# EAGLE design WizFiShield (EAGLE 6.1)
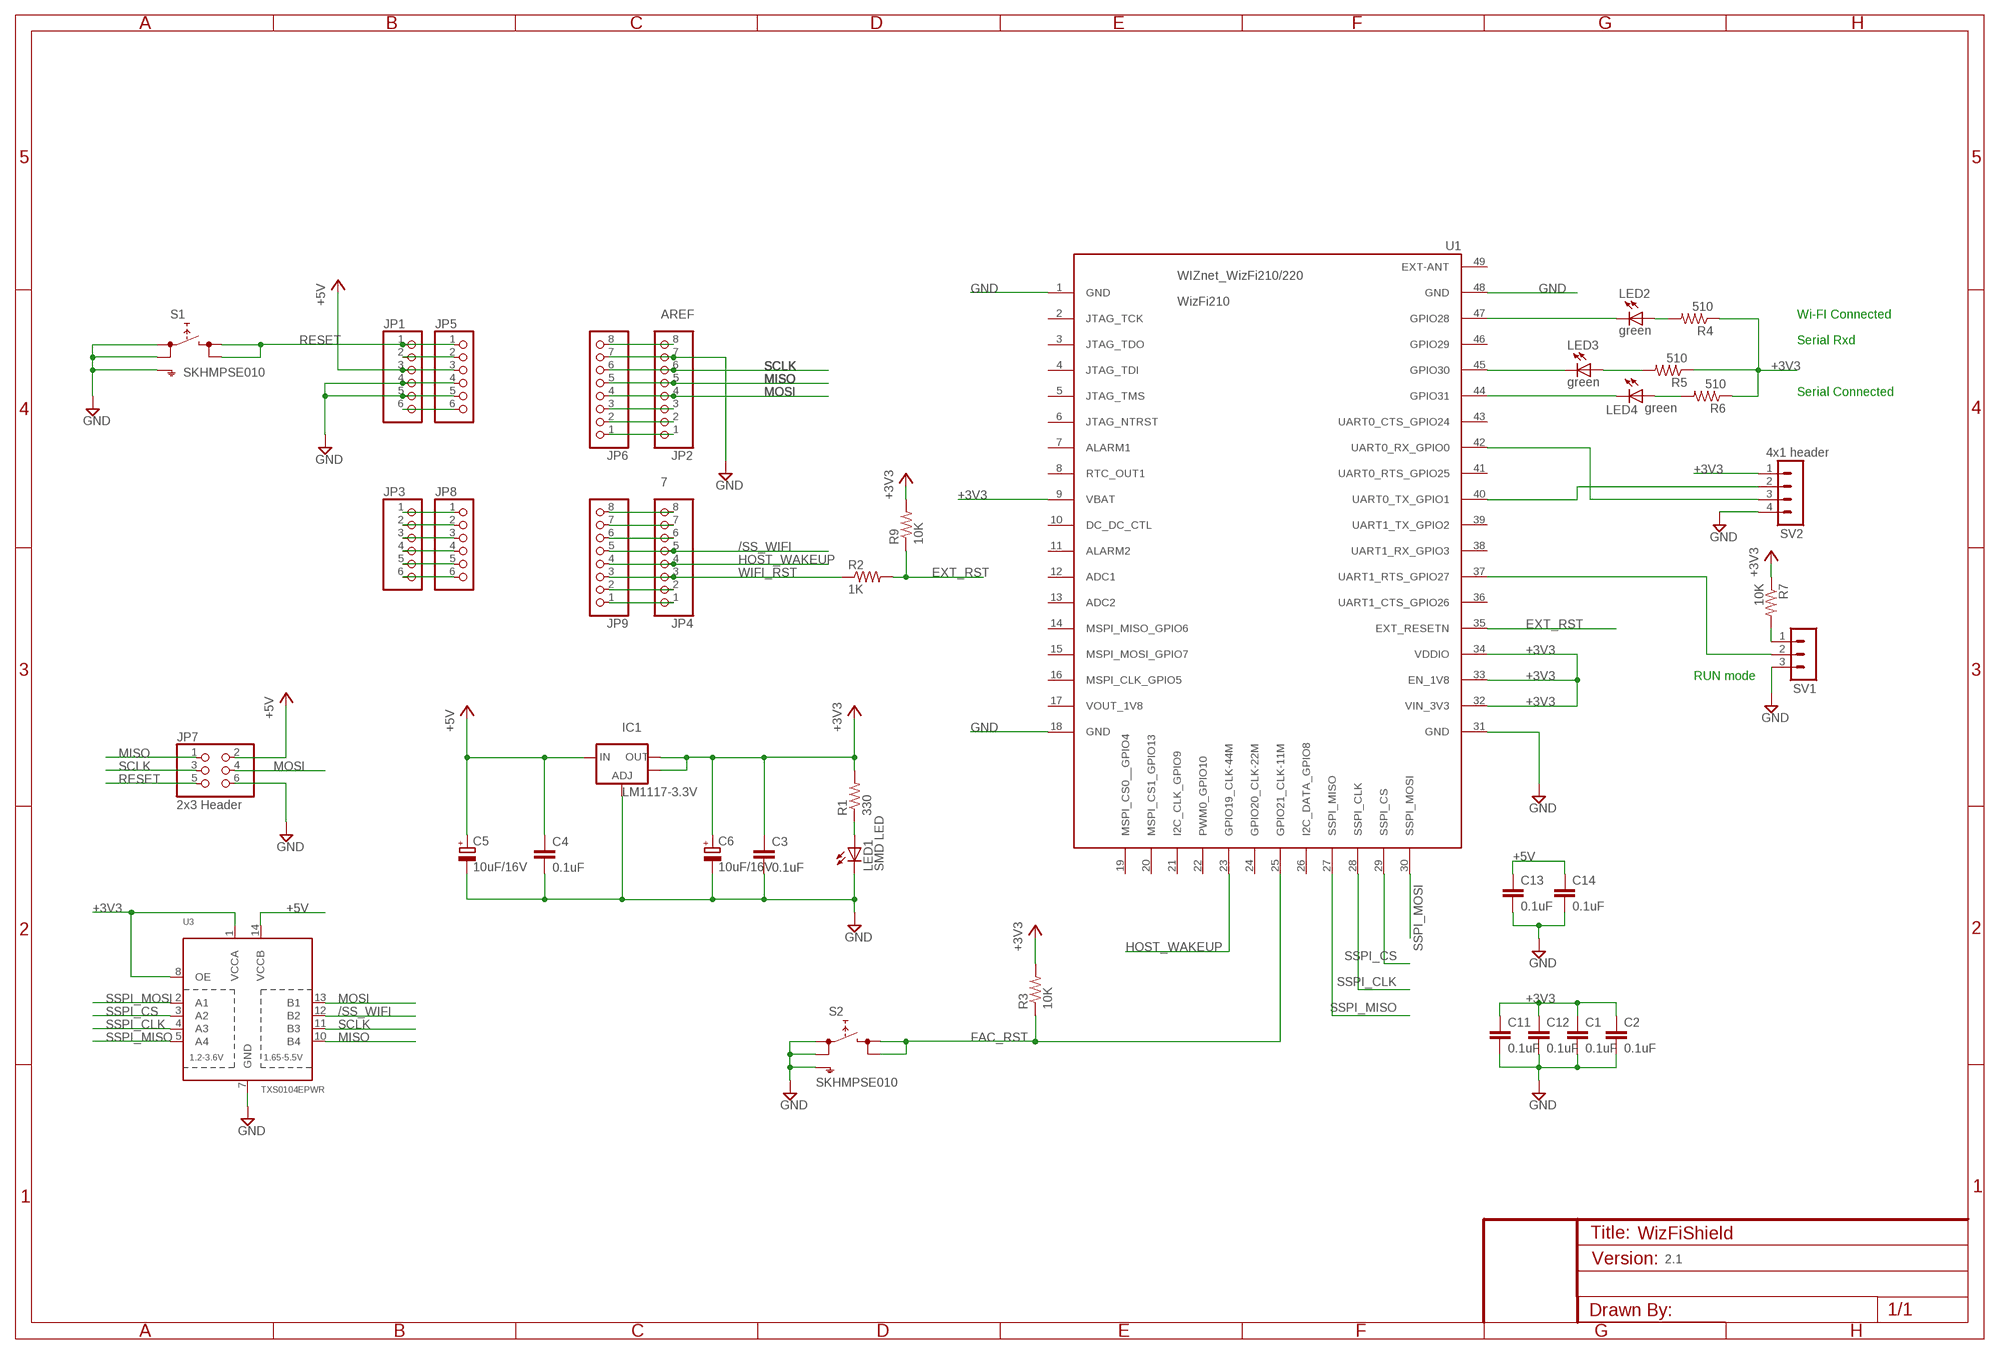
[diagram p0: schematic, sheet 1]

## Parts
C1  0.1uF  C-EUC0603  [C0603]
C2  0.1uF  C-EUC0603  [C0603]
C3  0.1uF  C-EUC0603  [C0603]
C4  0.1uF  C-EUC0603  [C0603]
C5  10uF/16V  CPOL-EUCT3216  [CT3216]
C6  10uF/16V  CPOL-EUCT3216  [CT3216]
C11  0.1uF  C-EUC0603  [C0603]
C12  0.1uF  C-EUC0603  [C0603]
C13  0.1uF  C-EUC0603  [C0603]
C14  0.1uF  C-EUC0603  [C0603]
IC1  LM1117-3.3V  V_REG_LM1117SOT223  [SOT223]
JP1  PINHD-1X6  [1X06]
JP2  PINHD-1X8  [1X08]
JP3  PINHD-1X6  [1X06]
JP4  PINHD-1X8  [1X08]
JP5  PINHD-1X6  [1X06]
JP6  PINHD-1X8  [1X08]
JP7  2x3 Header  PINHD-2X3  [2X03]
JP8  PINHD-1X6  [1X06]
JP9  PINHD-1X8  [1X08]
LED1  SMD LED  LEDCHIP-LED0805  [CHIP-LED0805]
LED2  green  LEDCHIP-LED0805  [CHIP-LED0805]
LED3  green  LEDCHIP-LED0805  [CHIP-LED0805]
LED4  green  LEDCHIP-LED0805  [CHIP-LED0805]
R1  330  R-US_R0805  [R0805]
R2  1K  RESISTOR0603-RES  [0603-RES]
R3  10K  RESISTOR0603-RES  [0603-RES]
R4  510  RESISTOR0603-RES  [0603-RES]
R5  510  RESISTOR0603-RES  [0603-RES]
R6  510  RESISTOR0603-RES  [0603-RES]
R7  10K  RESISTOR0603-RES  [0603-RES]
R9  10K  RESISTOR0603-RES  [0603-RES]
S1  SKHMPSE010  [SKHMPXE010]
S2  SKHMPSE010  [SKHMPXE010]
SV1  MA03-1  [MA03-1]
SV2  4x1 header  MA04-1  [MA04-1]
U1  WizFi210  WIZFI210/220  [WIZFI210/220]
U3  TXS0104EPWR  TXB0104PWR  [TSSOP14]

## Nets
+3V3: C1.1 C2.1 C3.1 C6.+ C11.1 C12.1 IC1.2(OUT) IC1.4(OUT) R1.2 R3.2 R4.1 R5.1 R6.1 R7.1 R9.2 SV2.1 U1.9(VBAT) U1.32(VIN_3V3) U1.33(EN_1V8) U1.34(VDDIO) U3.1(VCCA) U3.8(OE)
+5V: C4.1 C5.+ C13.1 C14.1 IC1.3(IN) JP1.3 JP5.3 JP7.2 U3.14(VCCB)
/INT_WIZ: JP2.1 JP6.1
/RESET_WIZ: JP4.6 JP9.6
/SD_DET: JP4.8 JP9.8
/SS_SD: JP2.2 JP6.2
/SS_WIFI: JP4.5 JP9.5 U3.12(B2)
/SS_WIZ: JP2.3 JP6.3
EXT_RST: R2.2 R9.1 U1.35(EXT_RESETN)
FAC_RST: R3.1 S2.3(2.1) S2.4(2.2) U1.25(GPIO21_CLK-11M)
GND: C1.2 C2.2 C3.2 C4.2 C5.- C6.- C11.2 C12.2 C13.2 C14.2 IC1.1(ADJ) JP1.4 JP1.5 JP2.7 JP5.4 JP5.5 JP6.7 JP7.6 LED1.C S1.1(1.1) S1.2(1.2) S1.5(SH) S2.1(1.1) S2.2(1.2) S2.5(SH) SV1.3 SV2.4 U1.1(GND) U1.18(GND) U1.31(GND) U1.48(GND) U3.7(GND)
GPIO28: LED2.C U1.47(GPIO28)
GPIO30: LED3.C U1.45(GPIO30)
GPIO31: LED4.C U1.44(GPIO31)
HOST_WAKEUP: JP4.4 JP9.4 U1.23(GPIO19_CLK-44M)
MISO: JP2.5 JP6.5 JP7.1 U3.10(B4)
MOSI: JP2.4 JP6.4 JP7.4 U3.13(B1)
N$1: R7.2 SV1.1
N$2: JP3.1 JP8.1
N$3: JP3.2 JP8.2
N$4: JP3.3 JP8.3
N$5: SV1.2 U1.37(UART1_RTS_GPIO27)
N$6: JP3.4 JP8.4
N$8: JP3.5 JP8.5
N$9: JP3.6 JP8.6
N$10: JP2.8 JP6.8
N$11: JP4.2 JP9.2
N$12: JP4.1 JP9.1
N$13: JP1.6 JP5.6
N$14: JP1.2 JP5.2
N$15: LED1.A R1.1
N$50: LED2.A R4.2
N$51: LED3.A R5.2
N$53: LED4.A R6.2
PWDN: JP4.7 JP9.7
RESET: JP1.1 JP5.1 JP7.5 S1.3(2.1) S1.4(2.2)
SCLK: JP2.6 JP6.6 JP7.3 U3.11(B3)
SSPI_CLK: U1.28(SSPI_CLK) U3.4(A3)
SSPI_CS: U1.29(SSPI_CS) U3.3(A2)
SSPI_MISO: U1.27(SSPI_MISO) U3.5(A4)
SSPI_MOSI: U1.30(SSPI_MOSI) U3.2(A1)
UART0_RX: SV2.3 U1.42(UART0_RX_GPIO0)
UART0_TX: SV2.2 U1.40(UART0_TX_GPIO1)
WIFI_RST: JP4.3 JP9.3 R2.1
Unconnected: U1.2(JTAG_TCK) U1.3(JTAG_TDO) U1.4(JTAG_TDI) U1.5(JTAG_TMS) U1.6(JTAG_NTRST) U1.7(ALARM1) U1.8(RTC_OUT1) U1.10(DC_DC_CTL) U1.11(ALARM2) U1.12(ADC1) U1.13(ADC2) U1.14(MSPI_MISO_GPIO6) U1.15(MSPI_MOSI_GPIO7) U1.16(MSPI_CLK_GPIO5) U1.17(VOUT_1V8) U1.19(MSPI_CS0__GPIO4) U1.20(MSPI_CS1_GPIO13) U1.21(I2C_CLK_GPIO9) U1.22(PWM0_GPIO10) U1.24(GPIO20_CLK-22M) U1.26(I2C_DATA_GPIO8) U1.36(UART1_CTS_GPIO26) U1.38(UART1_RX_GPIO3) U1.39(UART1_TX_GPIO2) U1.41(UART0_RTS_GPIO25) U1.43(UART0_CTS_GPIO24) U1.46(GPIO29) U1.49(EXT-ANT)

## Notes on the sheet
- AREF | Wi-FI Connected
- Serial Rxd
- SCLK
- MISO
- MOSI | Serial Connected
- 7
- RUN mode
- 2.1

## Library data of the parts
C1-C4 C11-C14 = resistor:C-EU: CAPACITOR, European symbol
C5 C6 = rcl:CPOL-EU: POLARIZED CAPACITOR, European symbol
IC1 = SparkFun:V_REG_LM1117: Voltage Regulator LM1117 Standard adjustable voltage regulator but in SMD form. Spark Fun Electronics SKU : COM-00595
JP1 JP3 JP5 JP8 = pinhead:PINHD-1X6: PIN HEADER
JP2 JP4 JP6 JP9 = pinhead:PINHD-1X8: PIN HEADER
JP7 = pinhead:PINHD-2X3: PIN HEADER
LED1 = led:LED: LED
LED2-LED4 = adafruit:LED: LED
R1 = resistor:R-US_: RESISTOR, American symbol
R2-R7 R9 = SparkFun:RESISTOR: Resistor Basic schematic elements and footprints for 0603, 1206, and PTH resistors.
S1 S2 = switch:SKHMP*E010: 6.2 X 6.5mm TACT Switch (SMD) Source: http://www3.alps.co.jp/WebObjects/catalog.woa/PDF/E/Switch/Tact/SKHM/SKHM.PDF
SV1 = con-lstb:MA03-1: PIN HEADER; OC_FARNELL: unknown; OC_NEWARK: unknown
SV2 = con-lstb:MA04-1: PIN HEADER; OC_FARNELL: unknown; OC_NEWARK: unknown
U1 = _wiznet_2012-04-17:WIZFI210/220: WIZnet WizFi210 / 220 - Ultra Low Power “Serial to WiFi” Module
U3 = microbuilder:TXB0104PWR: 4-Bit Bi-Directional Level Shifter 1.2V-3.6V (VCCA) to 1.65V-5.5V (VCCB) bi-directional level shifter with auto direction sensing. Max data rate - VCCA 1.8V: 20Mbps (50ns), VCCA 3.3V: 100Mbps (10ns) Digikey: 296-21929-1-ND

## Board
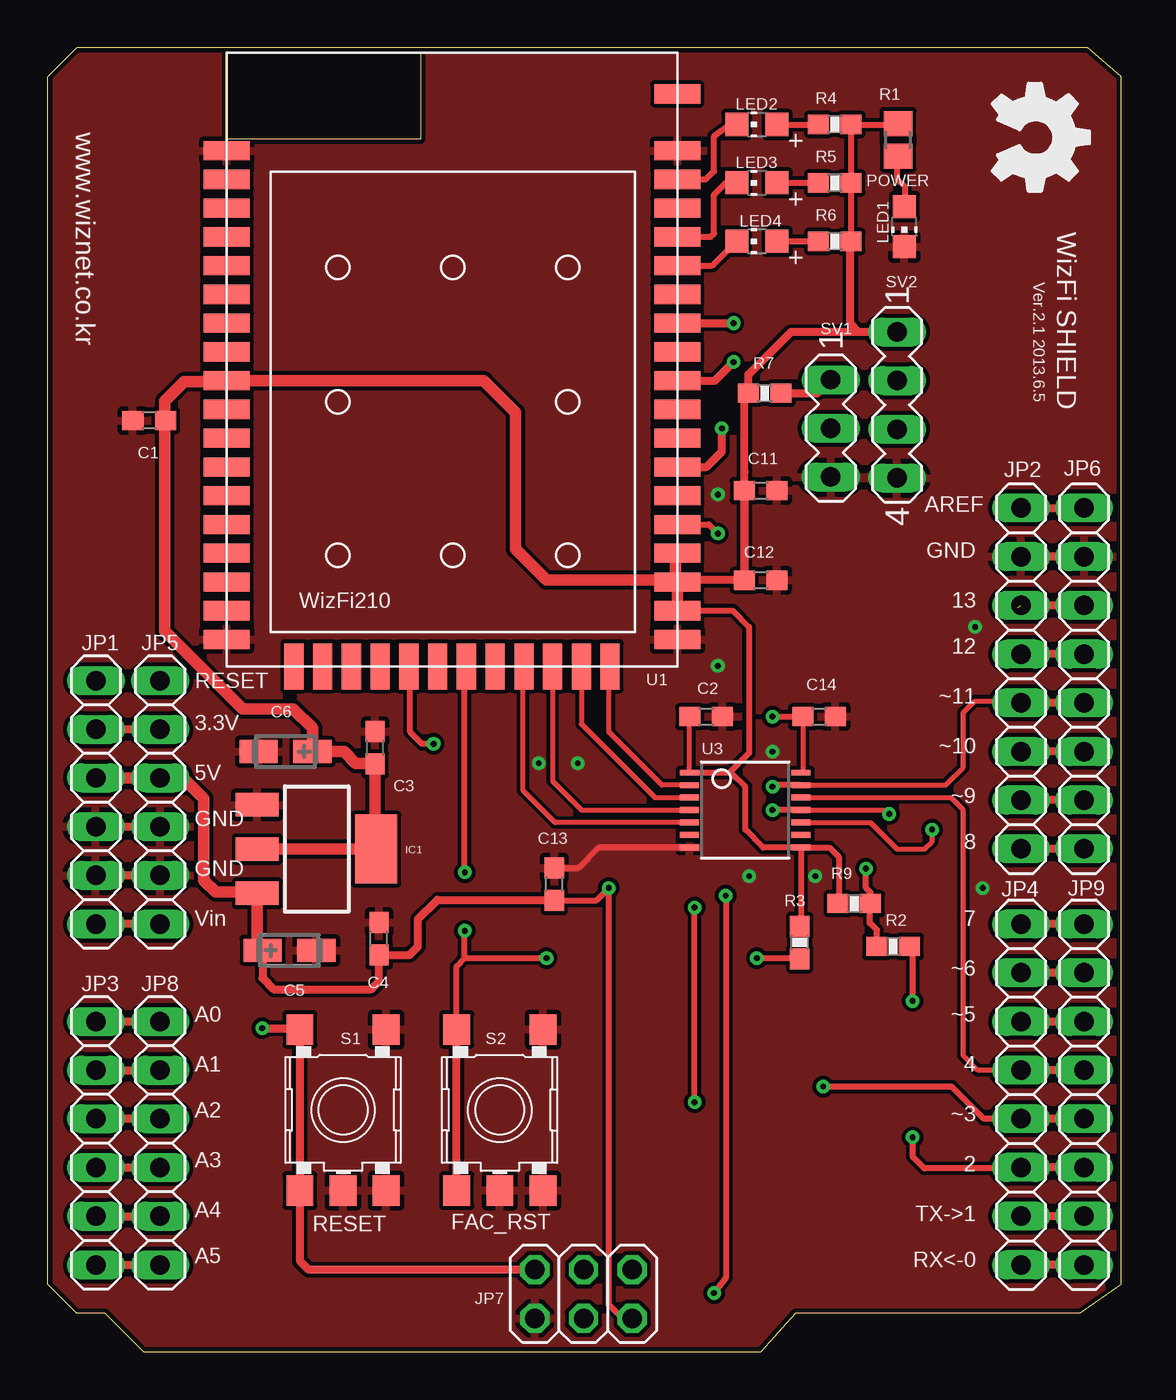
[diagram p1: board, top side]
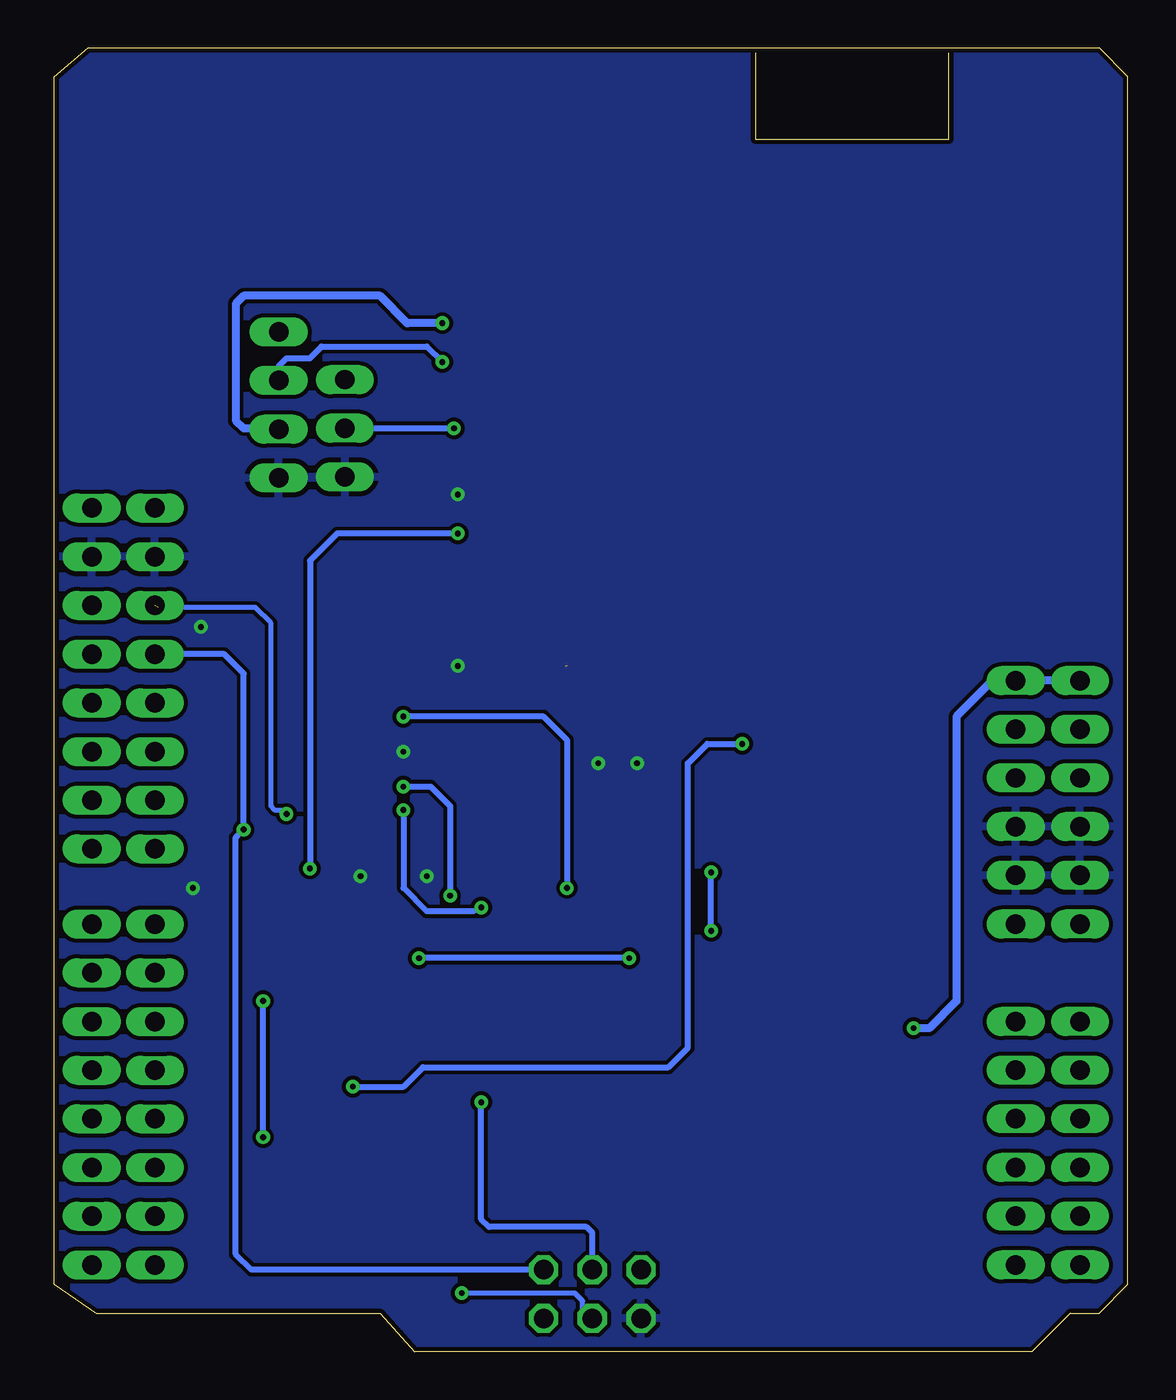
[diagram p2: board, bottom side, seen from below]

Size 56 x 68 mm. Coordinates in mm from the lower left corner, seen from the top.
Outline: 54.23,68 1.5,68 0,66.5 0,3.5 1.5,2 3,2 5,0 37.2,0 39,2 53.83,2 56,3.5 56,66.5 54.23,68
Copper layers (1*16): Top 0.035mm / dielectric 1.5mm / Bottom 0.035mm
Design rules: minimum track width 10mil, minimum drill 4mil, track to track 8mil, track to pad 8mil, pad to pad 8mil, via to via 8mil, smd to smd 8mil, copper to edge 10mil, drill to drill 8mil, minimum pad ring 10mil, minimum via ring 8mil, stop-mask expansion 4mil, vias tented up to drill 0mil, thermal gap 10mil

### Footprints (pad centres in the part's own frame; a part is rotated, then mirrored left to right if it is on the bottom)
C0603 = smd 1.1 x 1: 1 -0.85,0; 2 0.85,0
CT3216 = smd 2 x 1.2: + -1.4,0; - 1.4,0
SOT223 = smd 1.219 x 2.235: 1 -2.311,-3.099; 2 0,-3.099; 3 2.311,-3.099 | smd 3.6 x 2.2: 4 0,3.099
1X06 = drill 1.016 long: 1 -6.35,0; 2 -3.81,0; 3 -1.27,0; 4 1.27,0; 5 3.81,0; 6 6.35,0
1X08 = drill 1.016 long: 1 -8.89,0; 2 -6.35,0; 3 -3.81,0; 4 -1.27,0; 5 1.27,0; 6 3.81,0; 7 6.35,0; 8 8.89,0
2X03 = drill 1.016 octagon: 1 -2.54,-1.27; 2 -2.54,1.27; 3 0,-1.27; 4 0,1.27; 5 2.54,-1.27; 6 2.54,1.27
CHIP-LED0805 = smd 1.2 x 1.2: A 0,-1.05; C 0,1.05
R0805 = smd 1.3 x 1.5: 1 -0.85,0; 2 0.85,0
0603-RES = smd 1.1 x 1: 1 -0.85,0; 2 0.85,0
SKHMPXE010 = smd 1.6 x 1.4: 1 -4.2,2.25; 2 4.2,2.25; 3 -4.2,-2.25; 4 4.2,-2.25; 5 4.2,0
MA03-1 = drill 1.016 long: 1 -2.54,0; 2 0,0; 3 2.54,0
MA04-1 = drill 1.016 long: 1 -3.81,0; 2 -1.27,0; 3 1.27,0; 4 3.81,0
WIZFI210/220 = smd 2.4 x 1: 1 1.2,28.1; 2 1.2,26.6; 3 1.2,25.1; 4 1.2,23.6; 5 1.2,22.1; 6 1.2,20.6; 7 1.2,19.1; 8 1.2,17.6; 9 1.2,16.1; 10 1.2,14.6; 11 1.2,13.1; 12 1.2,11.6; 13 1.2,10.1; 14 1.2,8.6; 15 1.2,7.1; 16 1.2,5.6; 17 1.2,4.1; 18 1.2,2.6; 31 24.7,2.6; 32 24.7,4.1; 33 24.7,5.6; 34 24.7,7.1; 35 24.7,8.6; 36 24.7,10.1; 37 24.7,11.6; 38 24.7,13.1; 39 24.7,14.6; 40 24.7,16.1; 41 24.7,17.6; 42 24.7,19.1; 43 24.7,20.6; 44 24.7,22.1; 45 24.7,23.6; 46 24.7,25.1; 47 24.7,26.6; 48 24.7,28.1; 49 24.7,31.05 | smd 1 x 2.4: 19 4.7,1.2; 20 6.2,1.2; 21 7.7,1.2; 22 9.2,1.2; 23 10.7,1.2; 24 12.2,1.2; 25 13.7,1.2; 26 15.2,1.2; 27 16.7,1.2; 28 18.2,1.2; 29 19.7,1.2; 30 21.2,1.2
TSSOP14 = smd 0.305 x 0.991: 1 -1.95,-2.918; 2 -1.3,-2.918; 3 -0.65,-2.918; 4 0,-2.918; 5 0.65,-2.918; 6 1.3,-2.918; 7 1.95,-2.918; 8 1.95,2.918; 9 1.3,2.918; 10 0.65,2.918; 11 0,2.918; 12 -0.65,2.918; 13 -1.3,2.918; 14 -1.95,2.918

### Placement (x,y rotation side)
C1  5.28,48.56 180 top
C2  34.34,33.12 0 top
C3  17.07,31.5 90 top
C4  17.27,21.54 90 top
C5  12.6,20.93 0 top
C6  12.4,31.29 180 top
C11  37.19,44.91 0 top
C12  37.19,40.23 0 top
C13  26.42,24.38 90 top
C14  40.23,33.12 0 top
IC1  14.02,26.21 270 top
JP1  2.5,28.65 270 top
JP2  50.76,35.11 90 top
JP3  2.5,10.87 270 top
JP4  50.76,13.41 90 top
JP5  5.85,28.65 270 top
JP6  54.05,35.11 90 top
JP7  27.94,3 180 top
JP8  5.85,10.87 270 top
JP9  54.05,13.41 90 top
LED1  44.68,58.67 180 top
LED2  36.98,64.01 90 top
LED3  36.98,60.96 90 top
LED4  36.98,57.91 90 top
R1  44.35,63.2 90 top
R2  44.09,21.13 180 top
R3  39.22,21.34 90 top
R4  41.05,64.01 180 top
R5  41.05,60.96 180 top
R6  41.05,57.91 180 top
R7  37.39,49.99 0 top
R9  42.06,23.37 180 top
S1  15.39,12.6 270 top
S2  23.57,12.6 270 top
SV1  40.84,48.16 270 top
SV2  44.3,49.38 270 top
U1  8.13,34.54 0 top
U3  36.37,28.24 270 top
U$1  [OSHW_FILLX200_NOTEXT]  49.25,66.17 270 top

### Tracks (layer width: path | path; a pad name or v marks a point on that pad's centre or on a via)
+3V3
  Top 0.254: U3.1 33.45,33.05 33.53,33.12
  Top 0.305: U3.8 37.31,26.3 36.37,27.23 36.37,29.46 35.64,30.2 35.56,30.2 | U3.1 35.56,30.2 | R4.1 41.86,64.01 | R4.1 44.31,64.01 | R4.1 R5.1 R6.1 | U3.8 39.29,22.26 R3.2 | U1.32 35.73,38.64 36.58,37.8 36.58,31.21 35.56,30.2 | U3.8 40.76,26.3 41.25,25.81 41.25,23.57 41.15,23.47 41.05,23.37
  Top 0.406: C12.1 32.92,40.23 U1.33 | 36.34,45.89 C11.1 C12.1 | R6.1 41.86,57.88 41.86,53.65 42.32,53.19 SV2.1 38.76,53.19 36.54,50.97 R7.1 36.34,49.78 36.34,40.2 36.37,40.23 C12.1 | 9.28,50.6 U1.9 | C1.1 6.1,48.56 | 17.03,30.68 C3.1 | R9.2 41.15,23.37 41.15,23.47 | R1.2 44.31,64.05 44.31,64.01 | C2.1 33.45,33.12 33.45,33.05
  Top 0.61: U1.9 22.71,50.64 24.38,48.97 24.38,41.86 26.01,40.23 32.74,40.23 | 32.74,40.23 U1.33 U1.32 | 32.74,40.23 32.74,41.55 U1.34 | 9.28,50.6 7.11,50.6 6.1,49.58 6.1,48.56 6.1,37.59 10.16,33.53 12.8,33.53 13.79,32.53 C6.+ 15.44,31.29 16.05,30.68 17.03,30.68 | IC1.2 17.07,26.21 | 17.07,26.21 17.27,26.42 | C3.1 17.07,26.26 IC1.4 17.07,26.21
+5V  (via drill 0.3)
  Top 0.254: 39.22,33.12 C14.1 39.38,30.29 U3.14
  Top 0.305: JP7.2 29.97,1.73 29.26,2.44 v29.26,24.18 28.61,23.53 C13.1 | v37.8,33.12 39.22,33.12
  Top 0.406: C13.1 26.38,23.57 20.32,23.57 19.3,22.55 19.3,21.13 18.86,20.69 C4.1 17.27,19.3 16.87,18.9 11.79,18.9 11.2,19.48 C5.+ 11.18,20.93
  Top 0.61: JP1.3 JP5.3 7.06,29.92 8.13,28.85 8.13,24.59 8.74,23.98 10.85,23.98 IC1.3 10.92,21.18 11.18,20.93
  Bottom 0.305: v29.26,24.18 29.26,31.9 30.48,33.12 v37.8,33.12
/INT_WIZ
  Top 0.406: JP6.1 JP2.1
/RESET_WIZ
  Top 0.406: JP4.6 JP9.6
/SD_DET
  Top 0.406: JP9.8 JP4.8
/SS_SD
  Top 0.406: JP6.2 JP2.2
/SS_WIFI
  Top 0.254: JP4.5 48.52,14.68 47.75,15.44 47.75,28.25 47.1,28.89 U3.12
  Top 0.406: JP9.5 JP4.5
/SS_WIZ
  Top 0.406: JP6.3 JP2.3
EXT_RST  (via drill 0.3)
  Top 0.254: R2.2 43.24,21.58
  Top 0.305: U1.35 34.48,43.14 v34.95,42.67 | R9.1 42.67,23.37 | R9.1 42.91,23.94 42.67,24.18 v42.67,25.2 | 43.24,21.58 43.24,21.98 42.88,22.35 42.88,23.33 R9.1
  Bottom 0.305: v34.95,42.67 41.25,42.67 42.67,41.25 v42.67,25.2
FAC_RST  (via drill 0.3)
  Top 0.305: S2.3 21.32,20.1 21.74,20.52 | 21.74,20.52 v26.01,20.52 | v36.98,20.52 39.18,20.52 R3.1 | 21.74,20.52 v21.74,21.95 | v21.74,24.99 21.74,35.66 U1.25
  Top 0.406: S2.4 S2.3
  Bottom 0.305: v26.01,20.52 v36.98,20.52 | v21.74,21.95 v21.74,24.99
GND  (via drill 0.3)
  Top 0.305: U3.7 28.73,26.3 27.67,25.23 C13.2
  Top 0.406: JP6.7 JP2.7 | JP5.5 JP1.5 | JP1.4 JP5.4
  other vias: 48.77,24.18 36.58,24.79 48.36,37.8 27.64,30.68 25.6,30.68 37.8,31.29 34.95,44.7 40.03,24.79 34.95,35.76
  pour Top: 0,68.28 0,0 56.29,0 56.29,6.3 56.08,68.28
  pour Bottom: -0.41,68.68 -0.41,0 54.25,0 54.25,0.2 56.29,0 56.08,68.68
GPIO28
  Top 0.305: U1.47 34.32,61.14 34.75,61.57 34.75,63.4 35.56,64.01 LED2.C
GPIO30
  Top 0.305: U1.45 34.57,58.14 34.75,58.32 34.75,60.35 35.36,60.96 LED3.C
GPIO31
  Top 0.305: U1.44 34.66,56.64 LED4.C
HOST_WAKEUP  (via drill 0.3)
  Top 0.305: JP4.4 48.82,12.14 47.14,13.82 v40.44,13.82 | v20.12,31.7 19.51,31.7 18.9,32.31 18.9,35.67 U1.23
  Top 0.406: JP9.4 JP4.4
  Bottom 0.305: v40.44,13.82 37.8,13.82 36.78,14.83 23.98,14.83 22.96,15.85 22.96,30.68 21.95,31.7 v20.12,31.7
MISO  (via drill 0.3)
  Top 0.254: U3.10 42.92,27.59 44.3,26.21 45.72,26.21 46.13,26.62 v46.13,27.23
  Top 0.406: JP6.5 JP2.5
  Bottom 0.305: JP2.5 47.14,36.37 46.13,35.36 v46.13,27.23 46.53,26.82 46.53,5.08 45.72,4.27 JP7.1
MOSI  (via drill 0.3)
  Top 0.254: U3.13 46.82,29.55 47.75,30.48 47.75,33.33 48.36,33.93 50.67,33.93 JP2.4
  Top 0.305: U3.13 37.88,29.55 v37.8,29.46 | v35.36,23.77 35.36,3.86 v34.75,3.05
  Top 0.406: JP6.4 JP2.4
  Bottom 0.254: 28.45,2.24 28.45,2.64 28.85,3.05 v34.75,3.05
  Bottom 0.305: v37.8,29.46 36.37,29.46 35.36,28.45 v35.36,23.77 | 28.45,2.24 JP7.4
N$1
  Top 0.406: R7.2 40.13,49.99 SV1.1
N$2
  Top 0.406: JP3.1 JP8.1
N$3
  Top 0.406: JP3.2 JP8.2
N$4
  Top 0.406: JP8.3 JP3.3
N$5  (via drill 0.3)
  Top 0.406: U1.37 34.36,46.14 35.15,46.94 v35.15,48.16
  Bottom 0.305: SV1.2 v35.15,48.16
N$6
  Top 0.406: JP3.4 JP8.4
N$8
  Top 0.406: JP3.5 JP8.5
N$9
  Top 0.406: JP3.6 JP8.6
N$10
  Top 0.406: JP2.8 JP6.8
N$11
  Top 0.406: JP9.2 JP4.2
N$12
  Top 0.406: JP9.1 JP4.1
N$13
  Top 0.406: JP5.6 2.64,22.3 JP1.6 2.44,22.3 2.44,22.35
N$14
  Top 0.406: JP5.2 JP1.2
N$15
  Top 0.305: R1.1 44.35,62.03 44.3,61.98 44.3,61.16 44.7,60.76 44.7,59.75 LED1.A
N$50
  Top 0.305: LED2.A R4.2
N$51
  Top 0.305: LED3.A R5.2
N$53
  Top 0.305: LED4.A R6.2
PWDN
  Top 0.406: JP9.7 JP4.7
RESET  (via drill 0.3)
  Top 0.406: JP7.5 13.61,4.27 13.14,4.74 S1.4 S1.3 13.21,16.8 13.21,16.87 v11.18,16.87
  Bottom 0.406: JP1.1 JP5.1 7.06,35 8.94,33.12 8.94,18.29 10.36,16.87 v11.18,16.87
SCLK  (via drill 0.3)  (1 unrouted)
  Top 0.254: U3.11 43.69,28.25 v43.89,28.04
  Top 0.305: U3.11 v37.8,28.25 | v33.73,13.01 v33.73,23.16
  Top 0.406: JP6.6 JP2.6
  Bottom 0.254: 50.6,38.81 45.52,38.81 44.7,38 44.7,28.45 44.5,28.25 44.09,28.25 v43.89,28.04
  Bottom 0.305: v37.8,28.25 37.8,24.18 36.58,22.96 34.14,22.96 v33.73,23.16 | JP7.3 27.94,6.2 28.25,6.5 33.33,6.5 33.73,6.91 v33.73,13.01
SSPI_CLK
  Top 0.254: U1.28 26.33,29.75 27.84,28.25 U3.4
SSPI_CS
  Top 0.254: U1.29 27.83,32.73 31.66,28.89 U3.3
SSPI_MISO
  Top 0.254: U3.5 26.46,27.59 24.79,29.26 24.79,35.71 U1.27
SSPI_MOSI  (1 unrouted)
  Top 0.254: U3.2 32.02,29.55 29.26,32.31 29.26,35.76
UART0_RX  (via drill 0.3)
  Top 0.406: U1.42 v35.76,53.64 v35.76,53.65
  Bottom 0.406: v35.76,53.65 37.59,53.65 39.01,55.07 46.13,55.07 46.53,54.66 46.53,48.56 46.13,48.16 44.35,48.16 SV2.3
UART0_TX  (via drill 0.3)
  Top 0.406: U1.40 34.79,50.64 v35.76,51.61
  Bottom 0.305: SV2.2 44.3,51.41 43.89,51.82 42.67,51.82 42.06,52.43 36.58,52.43 v35.76,51.61 35.97,51.82
WIFI_RST  (via drill 0.3)
  Top 0.305: JP4.3 50.65,9.6 50.6,9.55 45.72,9.55 45.11,10.16 v45.11,11.18 | v45.11,18.29 45.11,20.97 R2.1
  Top 0.406: JP9.3 JP4.3
  Bottom 0.305: v45.11,11.18 v45.11,18.29

### Text on the board
tNames: www.wiznet.co.kr | POWER | Ver.2.1 2013.6.5 | WizFi SHIELD | AREF | GND | WizFi210 | 13 | 12 | RESET | ~11 | 3.3V | ~10 | 5V | ~9 | GND | 8 | GND | Vin | 7 | ~6 | A0 | ~5 | A1 | 4 | A2 | ~3 | A3 | 2 | A4 | TX->1 | RESET | FAC_RST | A5 | RX<-0